# EAGLE schematic motor (EAGLE 4.16)
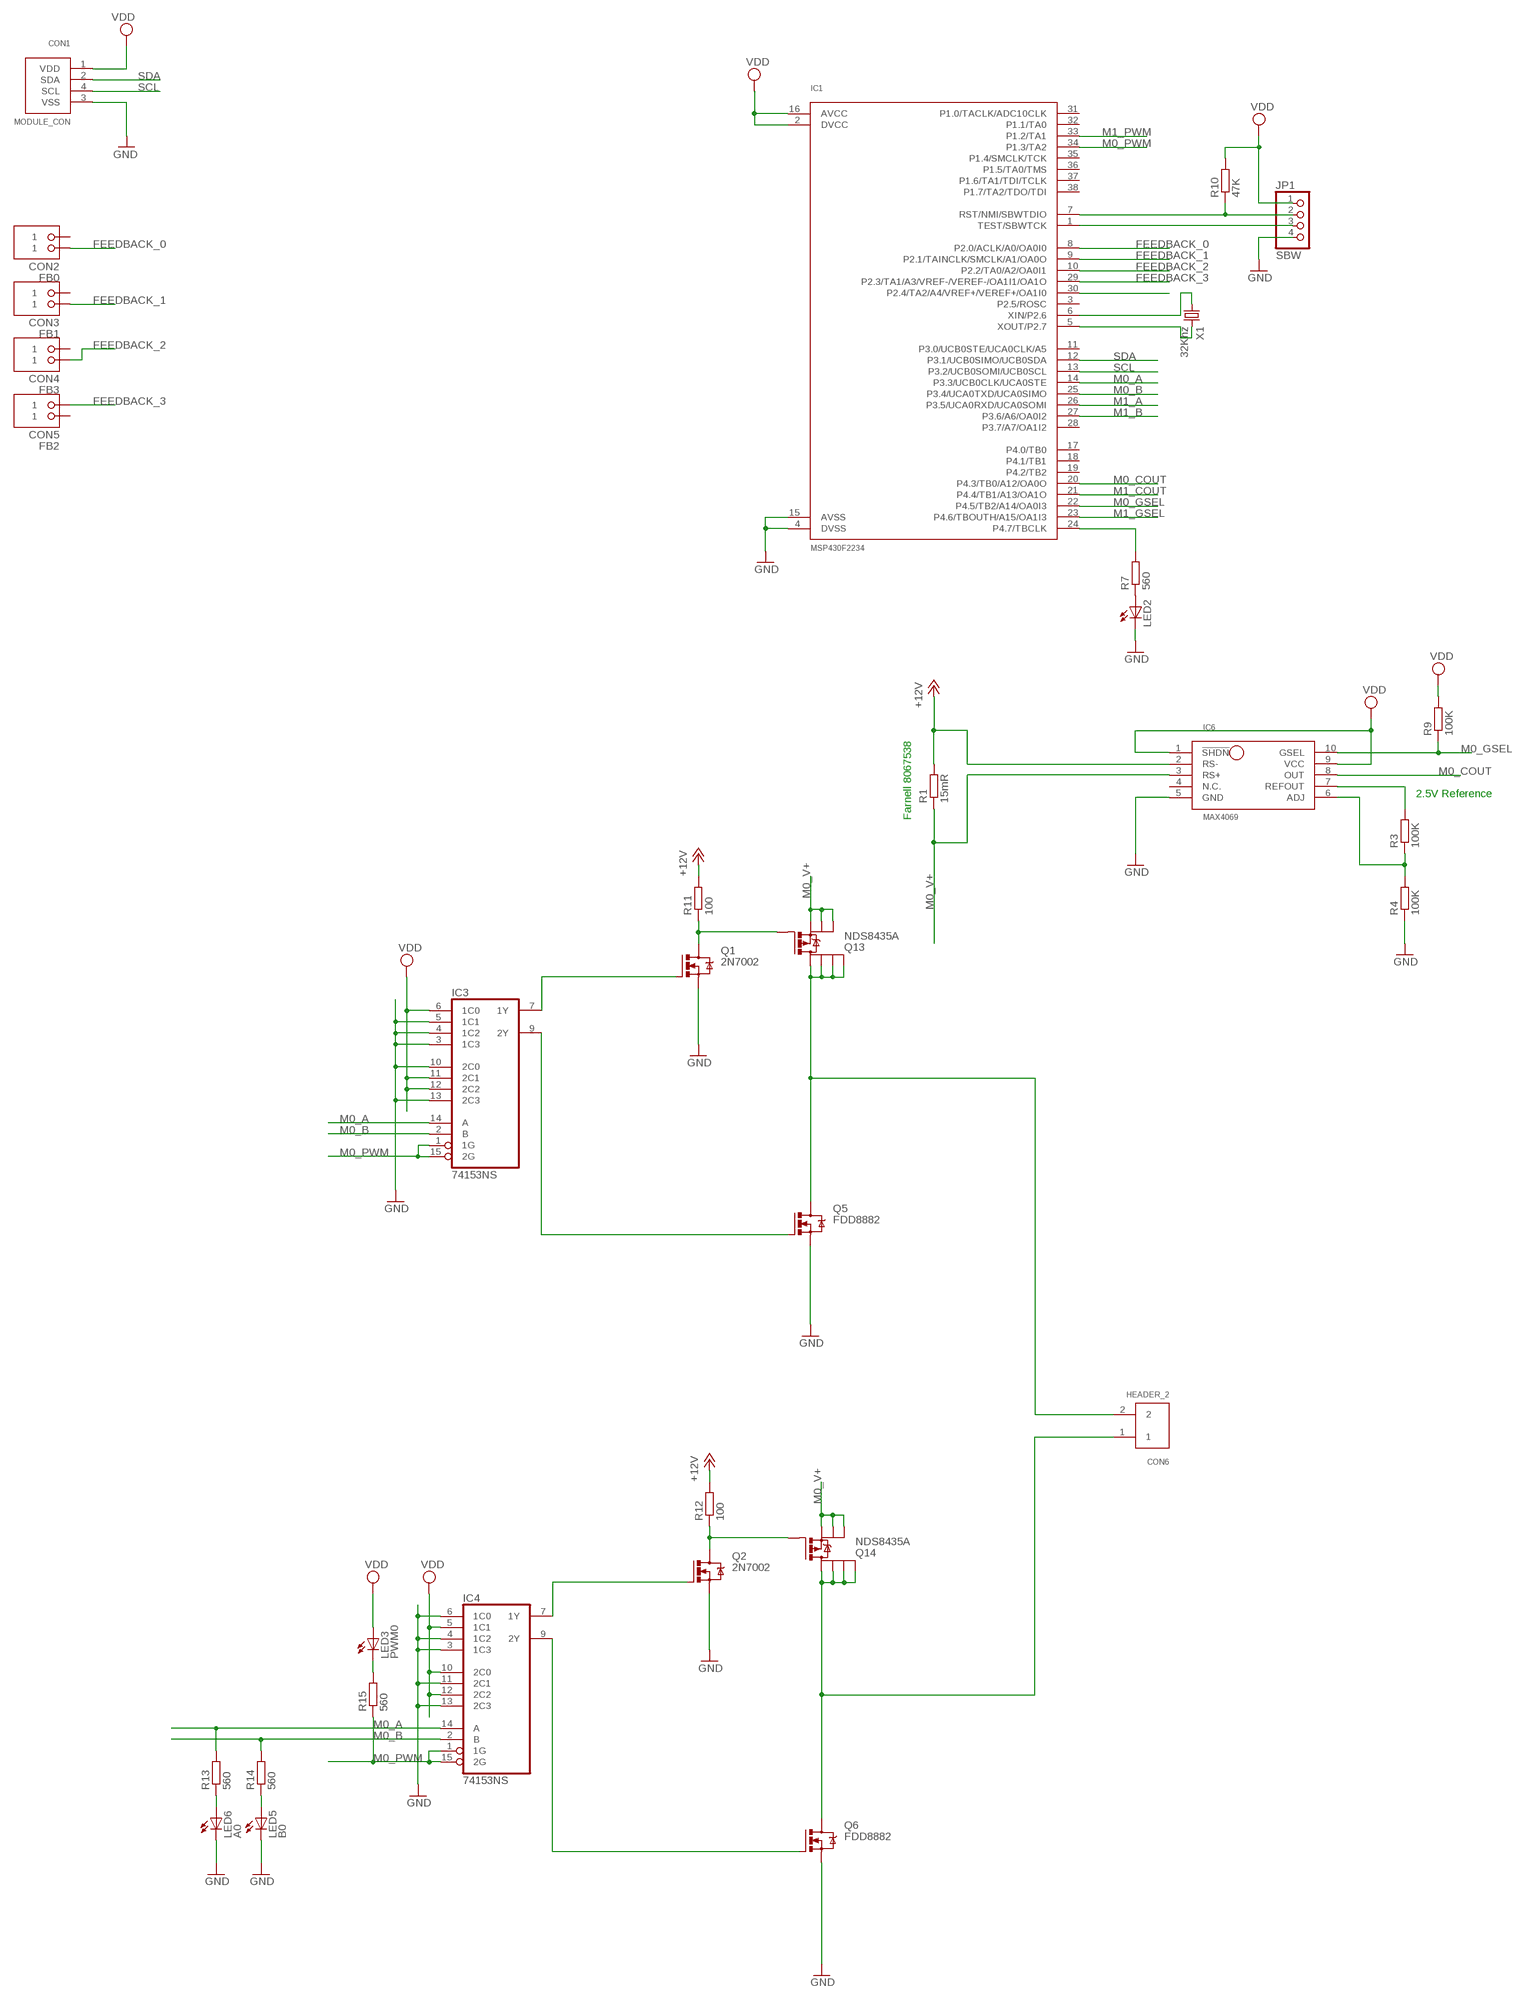
[diagram p0: schematic, sheet 1, part 1 of 2]
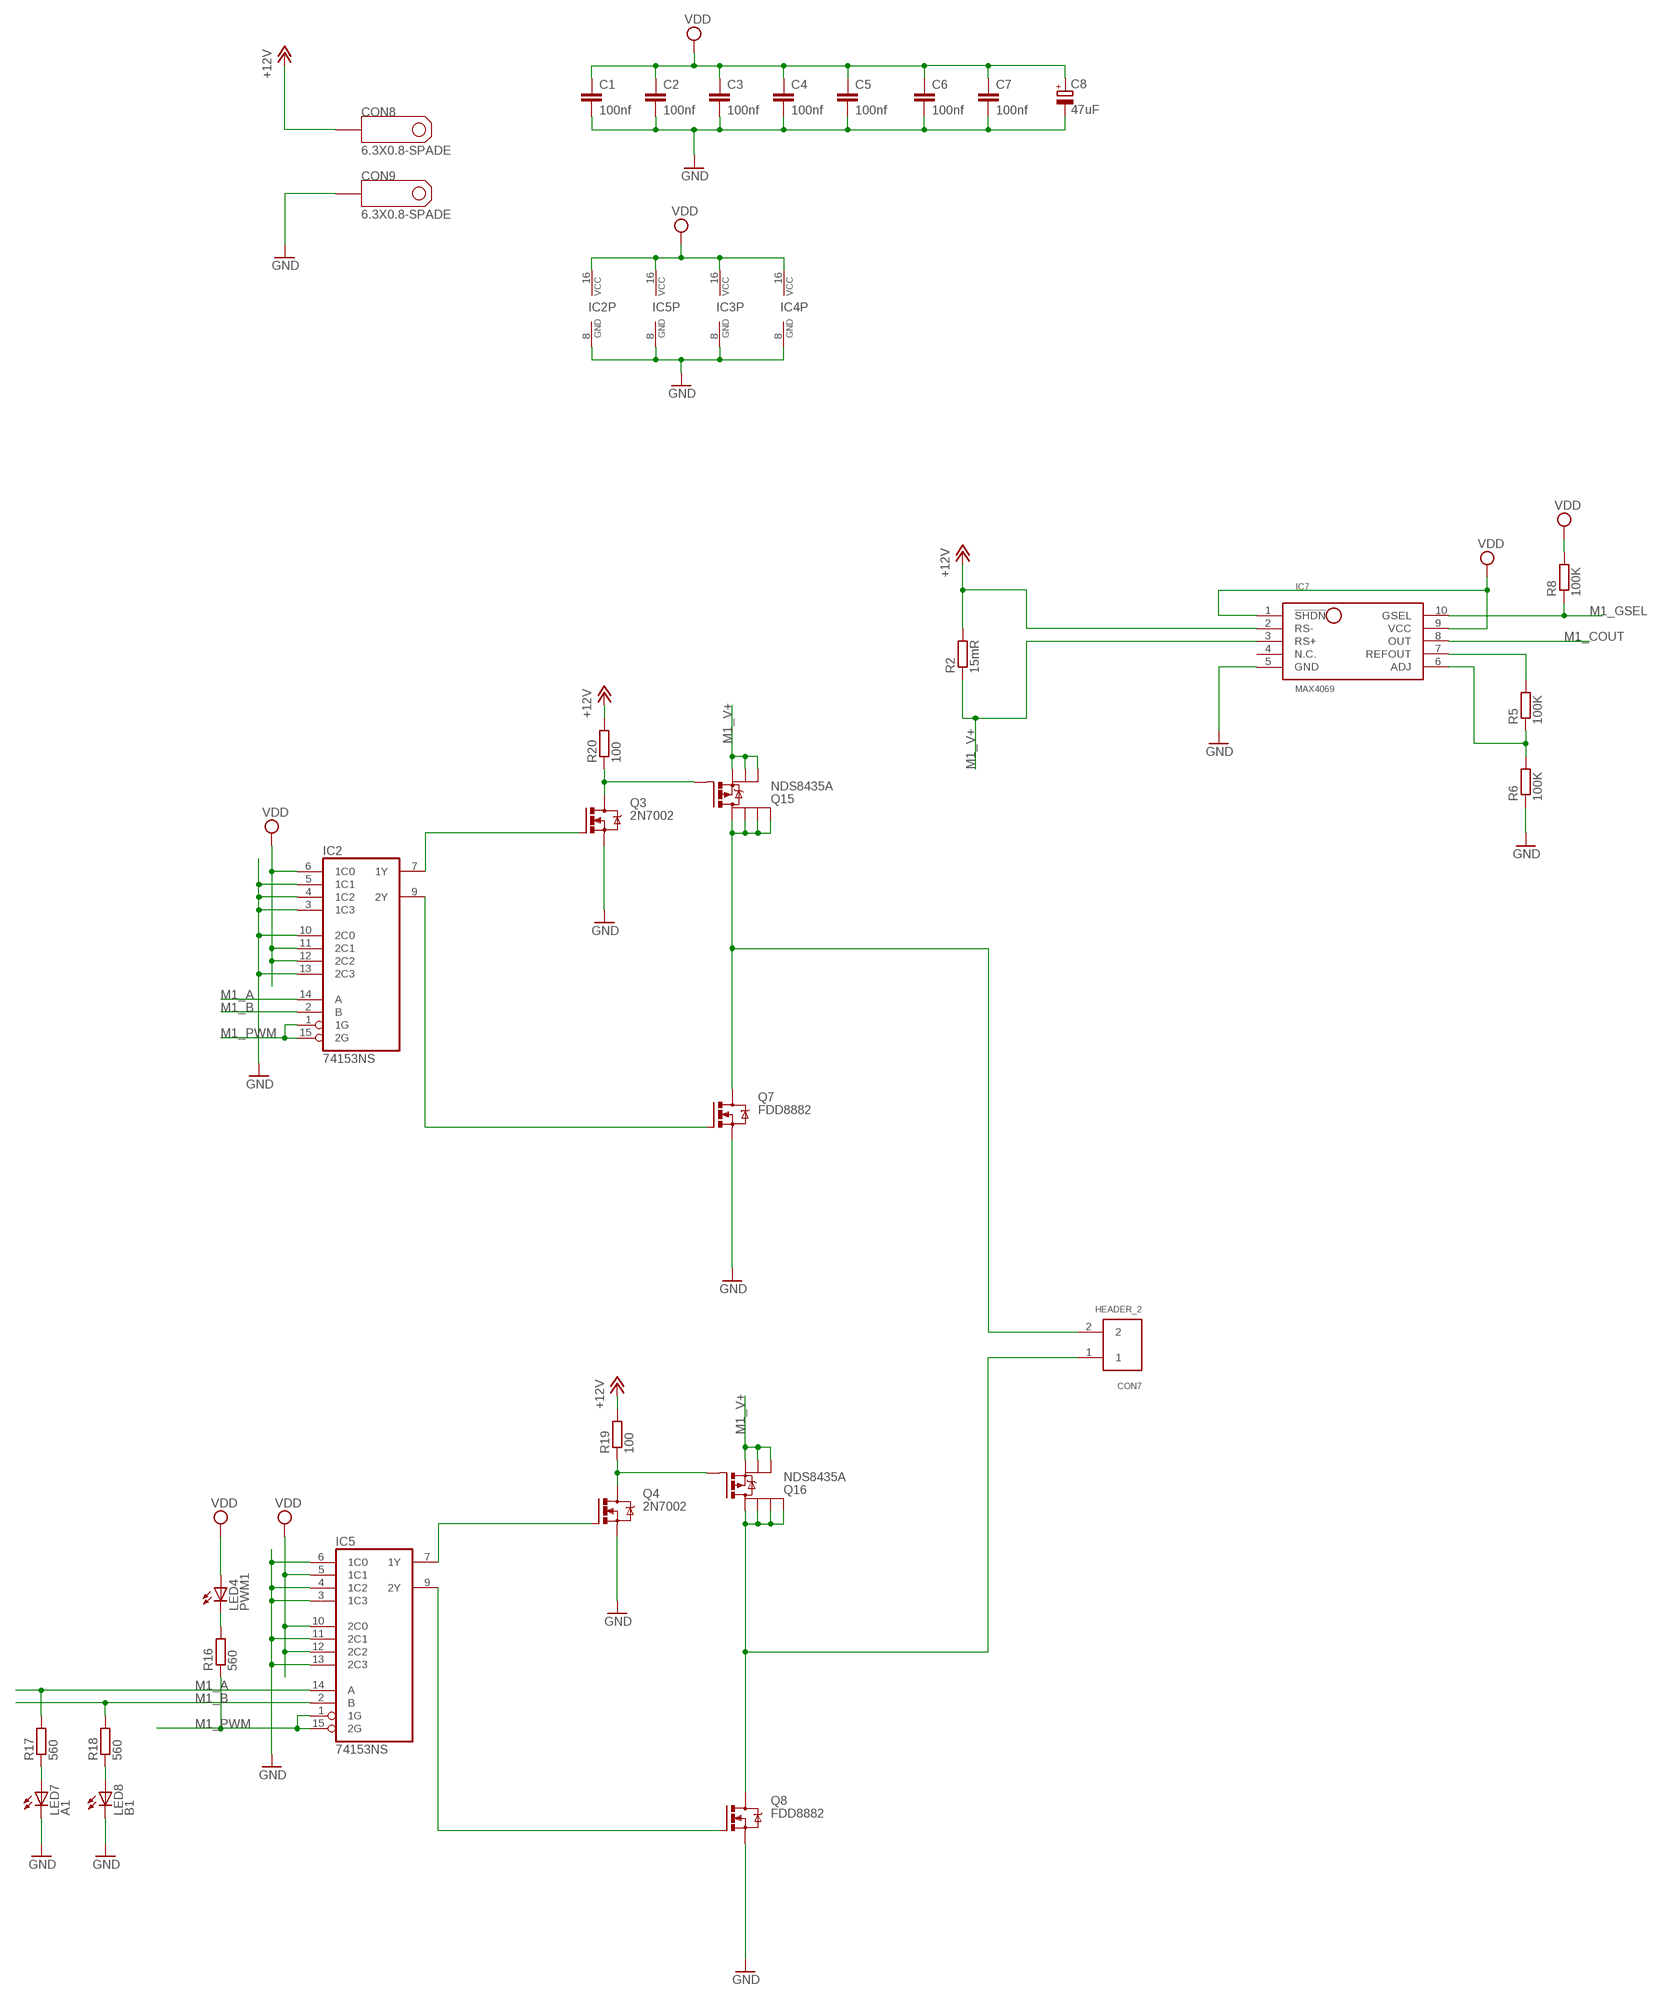
[diagram p1: schematic, sheet 1, part 2 of 2]

## Parts
C1  100nf  C-0603  [C0603]
C2  100nf  C-0603  [C0603]
C3  100nf  C-0603  [C0603]
C4  100nf  C-0603  [C0603]
C5  100nf  C-0603  [C0603]
C6  100nf  C-0603  [C0603]
C7  100nf  C-0603  [C0603]
C8  47uF  CPOL-EUE1.8-4  [E1,8-4]
CON1  MODULE_CON  [RJ11-4P4C]
CON2  FB0  CAGECLAMP  [CAGECLAMP]
CON3  FB1  CAGECLAMP  [CAGECLAMP]
CON4  FB3  CAGECLAMP  [CAGECLAMP]
CON5  FB2  CAGECLAMP  [CAGECLAMP]
CON6  HEADER_2  [LUMBERG_CAGE_2]
CON7  HEADER_2  [LUMBERG_CAGE_2]
CON8  6.3X0.8-SPADE  [SPADE]
CON9  6.3X0.8-SPADE  [SPADE]
IC1  MSP430F2234  [TSSOP38]
IC2  74153NS  [SOP16]
IC3  74153NS  [SOP16]
IC4  74153NS  [SOP16]
IC5  74153NS  [SOP16]
IC6  MAX4069  [UMAX]
IC7  MAX4069  [UMAX]
JP1  SBW  PINHD-1X4  [1X04]
LED2  LED3MM  [LED3MM]
LED3  PWM0  LED3MM  [LED3MM]
LED4  PWM1  LED3MM  [LED3MM]
LED5  B0  LED3MM  [LED3MM]
LED6  A0  LED3MM  [LED3MM]
LED7  A1  LED3MM  [LED3MM]
LED8  B1  LED3MM  [LED3MM]
Q1  2N7002  [SOT23]
Q2  2N7002  [SOT23]
Q3  2N7002  [SOT23]
Q4  2N7002  [SOT23]
Q5  FDD8882  [TO252-3]
Q6  FDD8882  [TO252-3]
Q7  FDD8882  [TO252-3]
Q8  FDD8882  [TO252-3]
Q13  NDS8435A  [SO08]
Q14  NDS8435A  [SO08]
Q15  NDS8435A  [SO08]
Q16  NDS8435A  [SO08]
R1  15mR  R-EU_M1206  [M1206]
R2  15mR  R-EU_M1206  [M1206]
R3  100K  R-EU_R0603  [R0603]
R4  100K  R-EU_R0603  [R0603]
R5  100K  R-EU_R0603  [R0603]
R6  100K  R-EU_R0603  [R0603]
R7  560  R-EU_R0603  [R0603]
R8  100K  R-EU_R0603  [R0603]
R9  100K  R-EU_R0603  [R0603]
R10  47K  R-EU_R0603  [R0603]
R11  100  R-EU_R0603  [R0603]
R12  100  R-EU_R0603  [R0603]
R13  560  R-EU_R0603  [R0603]
R14  560  R-EU_R0603  [R0603]
R15  560  R-EU_R0603  [R0603]
R16  560  R-EU_R0603  [R0603]
R17  560  R-EU_R0603  [R0603]
R18  560  R-EU_R0603  [R0603]
R19  100  R-EU_R0603  [R0603]
R20  100  R-EU_R0603  [R0603]
X1  32Khz  CRYSTALTC26H  [TC26H]

## Nets
+12V: CON8.P$2 IC6.2(RS-) IC7.2(RS-) R1.2 R2.2 R11.2 R12.2 R19.2 R20.2
FEEDBACK_0: CON2.2 IC1.8(P2.0/ACLK/A0/OA0I0)
FEEDBACK_1: CON3.2 IC1.9(P2.1/TAINCLK/SMCLK/A1/OA0O)
FEEDBACK_2: CON4.2 IC1.10(P2.2/TA0/A2/OA0I1)
FEEDBACK_3: CON5.1 IC1.29(P2.3/TA1/A3/VREF-/VEREF-/OA1I1/OA1O)
GND: C1.2 C2.2 C3.2 C4.2 C5.2 C6.2 C7.2 C8.- CON1.3(VSS) CON9.P$2 IC1.4(DVSS) IC1.15(AVSS) IC2.3(1C3) IC2.4(1C2) IC2.5(1C1) IC2.8(GND) IC2.10(2C0) IC2.13(2C3) IC3.3(1C3) IC3.4(1C2) IC3.5(1C1) IC3.8(GND) IC3.10(2C0) IC3.13(2C3) IC4.3(1C3) IC4.4(1C2) IC4.6(1C0) IC4.8(GND) IC4.11(2C1) IC4.13(2C3) IC5.3(1C3) IC5.4(1C2) IC5.6(1C0) IC5.8(GND) IC5.11(2C1) IC5.13(2C3) IC6.5(GND) IC7.5(GND) JP1.4 LED2.K(C) LED5.K(C) LED6.K(C) LED7.K(C) LED8.K(C) Q1.2(S) Q2.2(S) Q3.2(S) Q4.2(S) Q5.3(S) Q6.3(S) Q7.3(S) Q8.3(S) R4.1 R6.1
M0_A: IC1.14(P3.3/UCB0CLK/UCA0STE) IC3.14(A) IC4.14(A) R13.2
M0_B: IC1.25(P3.4/UCA0TXD/UCA0SIMO) IC3.2(B) IC4.2(B) R14.2
M0_COUT: IC1.20(P4.3/TB0/A12/OA0O) IC6.8(OUT)
M0_GSEL: IC1.22(P4.5/TB2/A14/OA0I3) IC6.10(GSEL) R9.1
M0_PWM: IC1.34(P1.3/TA2) IC3.1(1G) IC3.15(2G) IC4.1(1G) IC4.15(2G) R15.1
M0_V+: IC6.3(RS+) Q13.1(S) Q13.2(S) Q13.3(S) Q14.1(S) Q14.2(S) Q14.3(S) R1.1
M1_A: IC1.26(P3.5/UCA0RXD/UCA0SOMI) IC2.14(A) IC5.14(A) R17.2
M1_B: IC1.27(P3.6/A6/OA0I2) IC2.2(B) IC5.2(B) R18.2
M1_COUT: IC1.21(P4.4/TB1/A13/OA1O) IC7.8(OUT)
M1_GSEL: IC1.23(P4.6/TBOUTH/A15/OA1I3) IC7.10(GSEL) R8.1
M1_PWM: IC1.33(P1.2/TA1) IC2.1(1G) IC2.15(2G) IC5.1(1G) IC5.15(2G) R16.1
M1_V+: IC7.3(RS+) Q15.1(S) Q15.2(S) Q15.3(S) Q16.1(S) Q16.2(S) Q16.3(S) R2.1
N$1: IC1.7(RST/NMI/SBWTDIO) JP1.2 R10.1
N$2: IC1.24(P4.7/TBCLK) R7.2
N$3: CON6.2 Q5.2(D) Q13.5(D) Q13.6(D) Q13.7(D) Q13.8(D)
N$4: IC1.6(XIN/P2.6) X1.1
N$5: Q1.3(D) Q13.4(G) R11.1
N$6: LED2.A R7.1
N$7: LED4.K(C) R16.2
N$8: IC3.7(1Y) Q1.1(G)
N$10: IC1.1(TEST/SBWTCK) JP1.3
N$11: CON7.1 Q8.2(D) Q16.5(D) Q16.6(D) Q16.7(D) Q16.8(D)
N$12: CON7.2 Q7.2(D) Q15.5(D) Q15.6(D) Q15.7(D) Q15.8(D)
N$13: IC3.9(2Y) Q5.1(G)
N$14: CON6.1 Q6.2(D) Q14.5(D) Q14.6(D) Q14.7(D) Q14.8(D)
N$15: Q2.3(D) Q14.4(G) R12.1
N$16: LED5.A R14.1
N$17: IC4.7(1Y) Q2.1(G)
N$18: IC4.9(2Y) Q6.1(G)
N$19: IC1.5(XOUT/P2.7) X1.2
N$20: LED6.A R13.1
N$21: LED7.A R17.1
N$22: LED8.A R18.1
N$25: IC6.7(REFOUT) R3.2
N$26: Q3.3(D) Q15.4(G) R20.1
N$27: LED3.K(C) R15.2
N$28: IC6.6(ADJ) R3.1 R4.2
N$29: IC2.7(1Y) Q3.1(G)
N$30: IC2.9(2Y) Q7.1(G)
N$32: IC7.7(REFOUT) R5.2
N$33: IC7.6(ADJ) R5.1 R6.2
N$37: Q4.3(D) Q16.4(G) R19.1
N$39: IC5.7(1Y) Q4.1(G)
N$40: IC5.9(2Y) Q8.1(G)
N$46: IC1.30(P2.4/TA2/A4/VREF+/VEREF+/OA1I0)
SCL: CON1.4(SCL) IC1.13(P3.2/UCB0SOMI/UCB0SCL)
SDA: CON1.2(SDA) IC1.12(P3.1/UCB0SIMO/UCB0SDA)
VDD: C1.1 C2.1 C3.1 C4.1 C5.1 C6.1 C7.1 C8.+ CON1.1(VDD) IC1.2(DVCC) IC1.16(AVCC) IC2.6(1C0) IC2.11(2C1) IC2.12(2C2) IC2.16(VCC) IC3.6(1C0) IC3.11(2C1) IC3.12(2C2) IC3.16(VCC) IC4.5(1C1) IC4.10(2C0) IC4.12(2C2) IC4.16(VCC) IC5.5(1C1) IC5.10(2C0) IC5.12(2C2) IC5.16(VCC) IC6.1(!SHDN) IC6.9(VCC) IC7.1(!SHDN) IC7.9(VCC) JP1.1 LED3.A LED4.A R8.2 R9.2 R10.2
Unconnected: CON2.1 CON3.1 CON4.1 CON5.2 IC1.3(P2.5/ROSC) IC1.11(P3.0/UCB0STE/UCA0CLK/A5) IC1.17(P4.0/TB0) IC1.18(P4.1/TB1) IC1.19(P4.2/TB2) IC1.28(P3.7/A7/OA1I2) IC1.31(P1.0/TACLK/ADC10CLK) IC1.32(P1.1/TA0) IC1.35(P1.4/SMCLK/TCK) IC1.36(P1.5/TA0/TMS) IC1.37(P1.6/TA1/TDI/TCLK) IC1.38(P1.7/TA2/TDO/TDI)

## Notes on the sheet
- 2.5V Reference
- Farnell 8067538

## Power pins joined to a net without a drawn wire
N.C.: IC6.4(N.C.) IC7.4(N.C.)

## Library data of the parts
C1-C7 = quantum-sensor:C: Capacitor
C8 = rcl:CPOL-EU: POLARIZED CAPACITOR, European symbol
CON1 = ecssr:MODULE_CON
CON2-CON5 = ecssr:CAGECLAMP
CON6 CON7 = ecssr:HEADER_2
CON8 CON9 = ecssr-Pwr:6.3X0.8-SPADE
IC1 = ecssr:MSP430F2234
IC2-IC5 = ecssr:74*153: Dual 4-line to 1-line data SELECTOR/MULTIPLEXER
IC6 IC7 = ecssr-Pwr:MAX4069
JP1 = pinhead:PINHD-1X4: PIN HEADER
LED2-LED8 = led:LED: LED OSRAM: - CHIPLED LG R971, LG N971, LY N971, LG Q971, LY Q971, LO R971, LY R971 LH N974, LH R974 LS Q976, LO Q976, LY Q976 LO Q996 - Hyper CHIPLED LW Q18S LB Q993, LB Q99A, LB R99A - SideLED LS A670, LO A670, LY A670, LG A670, LP A670 LB A673, LV A673, LT A673, LW A673 LH A674 LY A675 LS A676, LA A676, LO A676, LY A676, LW A676 LS A679, LY A679, LG A679 - Hyper Micro SIDELED® LS Y876, LA Y876, LO Y876, LY Y876 LT Y87S - SmartLED LW L88C, LW L88S LB L89C, LB L89S, LG L890 LS L89K, LO L89K, LY L89K LS L896, LA L896, LO L896, LY L896 - TOPLED LS T670, LO T670, LY T670, LG T670, LP T670 LSG T670, LSP T670, LSY T670, LOP T670, LYG T670 LG T671, LOG T671, LSG T671 LB T673, LV T673, LT T673, LW T673 LH T674 LS T676, LA T676, LO T676, LY T676, LB T676, LH T676, LSB T676, LW T676 LB T67C, LV T67C, LT T67C, LS T67K, LO T67K, LY T67K, LW E67C LS E67B, LA E67B, LO E67B, LY E67B, LB E67C, LV E67C, LT E67C LW T67C LS T679, LY T679, LG T679 LS T770, LO T770, LY T770, LG T770, LP T770 LB T773, LV T773, LT T773, LW T773 LH T774 LS E675, LA E675, LY E675, LS T675 LS T776, LA T776, LO T776, LY T776, LB T776 LHGB T686 LT T68C, LB T68C - Hyper Mini TOPLED® LB M676 - Mini TOPLED Santana® LG M470 LS M47K, LO M47K, LY M47K Source: http://www.osram.convergy.de - LUMILED® LXK2-PW12-R00, LXK2-PW12-S00, LXK2-PW14-U00, LXK2-PW14-V00 LXK2-PM12-R00, LXK2-PM12-S00, LXK2-PM14-U00 LXK2-PE12-Q00, LXK2-PE12-R00, LXK2-PE12-S00, LXK2-PE14-T00, LXK2-PE14-U00 LXK2-PB12-K00, LXK2-PB12-L00, LXK2-PB12-M00, LXK2-PB14-N00, LXK2-PB14-P00, LXK2-PB14-Q00 LXK2-PR12-L00, LXK2-PR12-M00, LXK2-PR14-Q00, LXK2-PR14-R00 LXK2-PD12-Q00, LXK2-PD12-R00, LXK2-PD12-S00 LXK2-PH12-R00, LXK2-PH12-S00 LXK2-PL12-P00, LXK2-PL12-Q00, LXK2-PL12-R00 Source: www.luxeon.com
Q1-Q4 = ecssr:2N7002
Q5-Q8 = ecssr:FDD8882
Q13-Q16 = ecssr:NDS8435A
R1-R20 = rcl:R-EU_: RESISTOR, European symbol
X1 = crystal:CRYSTAL: CRYSTAL